# EAGLE design funky_super_usb_r2 (EAGLE 6.1)
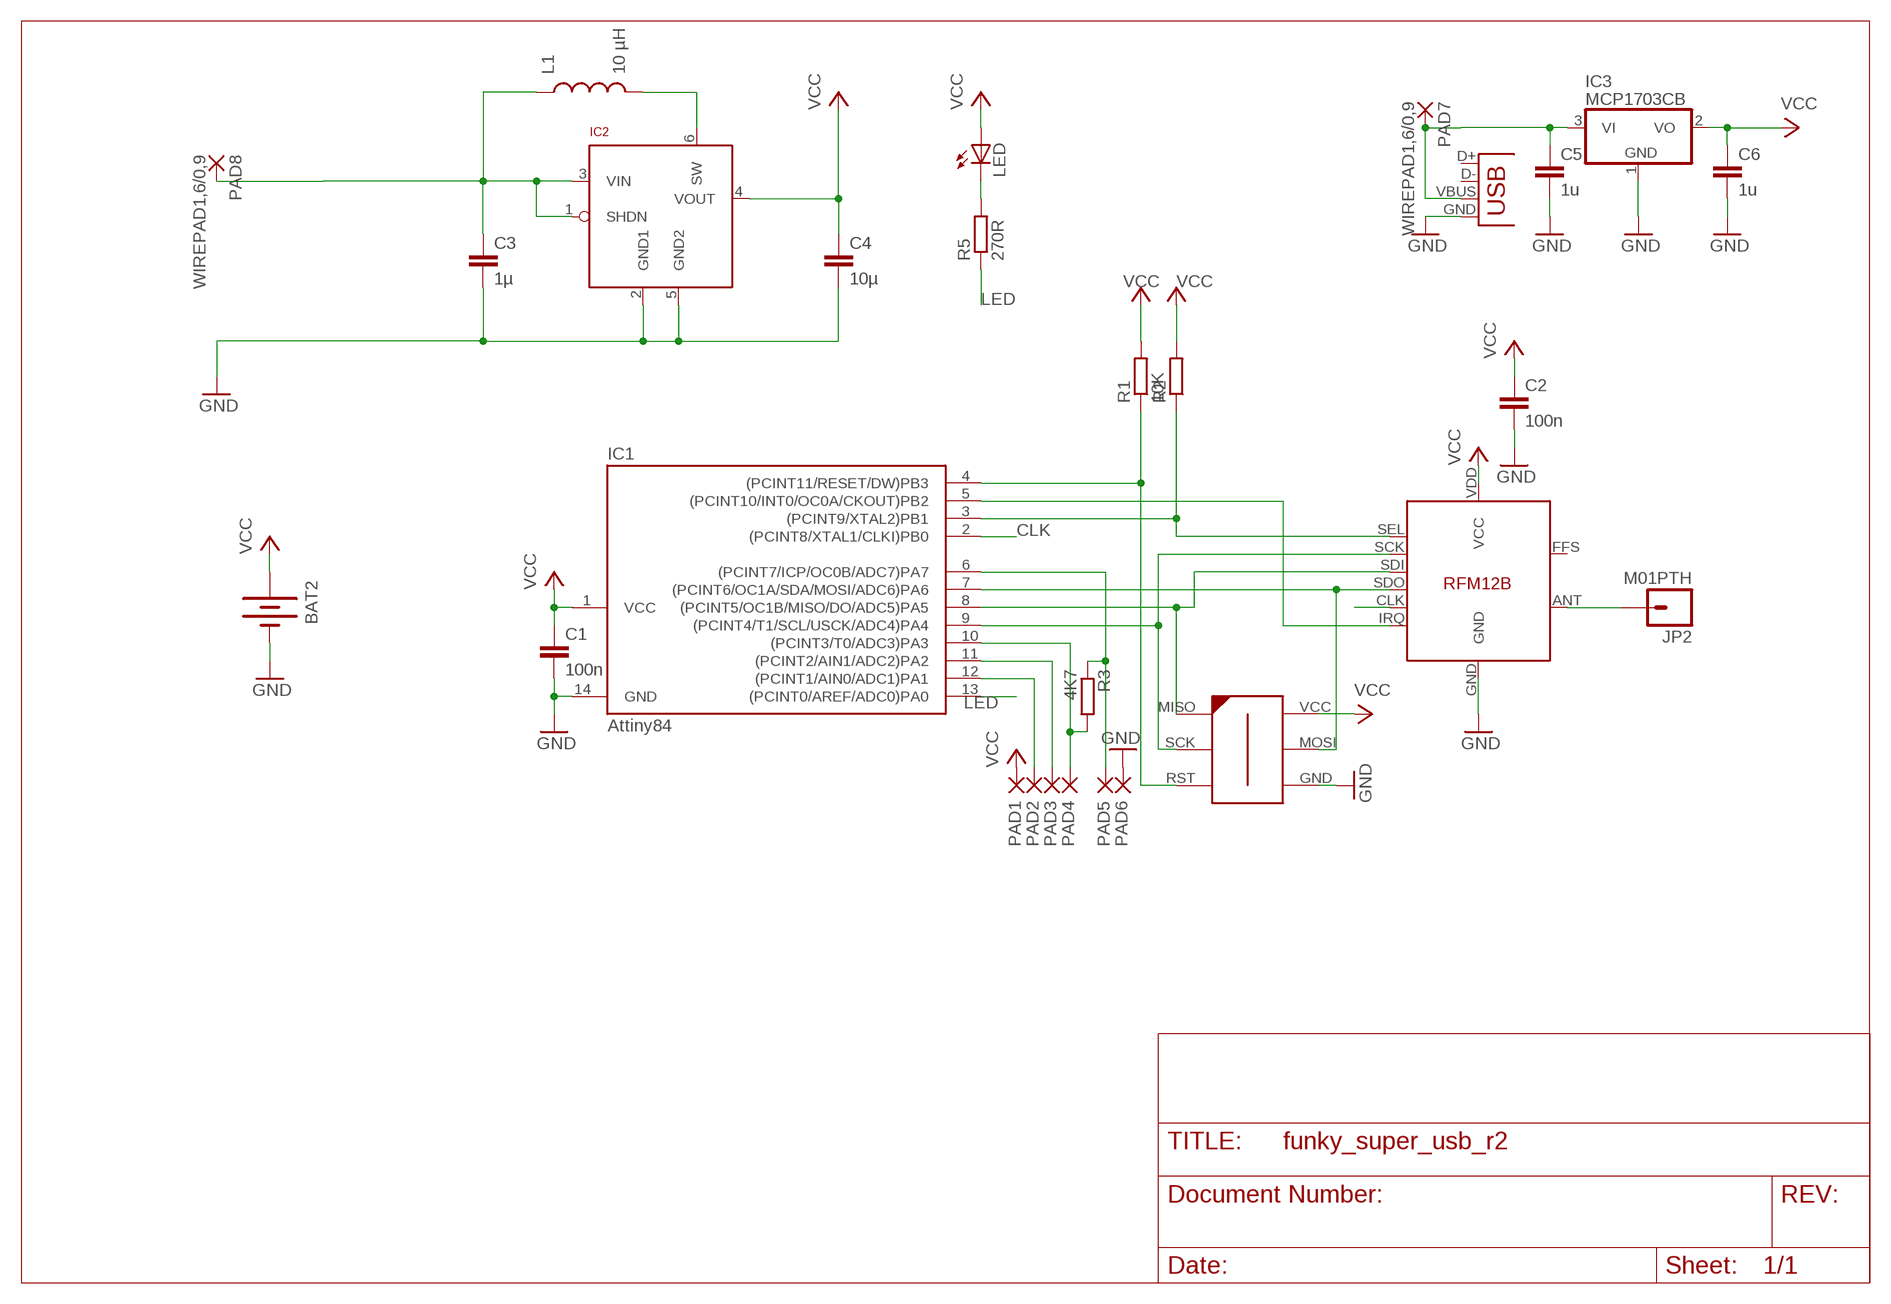
[diagram p0: schematic, sheet 1]

## Parts
BAT2  BATTERY20PTH  [BATTCOM_20MM_PTH]
C1  100n  C-EUC0603K  [C0603K]
C2  100n  C-EUC0603K  [C0603K]
C3  1µ  CAP0603-CAP  [0603-CAP]
C4  10µ  CAP0805  [0805]
C5  1u  C-EUC0603K  [C0603K]
C6  1u  C-EUC0603K  [C0603K]
IC1  Attiny84  TINY24/44/84-SSU  [SOIC14]
IC2  LTC3525  [SC70]
IC3  MCP1703CB  [SOT23]
JP2  M01PTH  [1X01]
L1  10 µH  INDUCTOR1210  [1210]
LED  LED0603  [LED-0603]
PAD1  SMD2  [SMD1,27-2,54]
PAD2  SMD2  [SMD1,27-2,54]
PAD3  SMD2  [SMD1,27-2,54]
PAD4  SMD2  [SMD1,27-2,54]
PAD5  SMD2  [SMD1,27-2,54]
PAD6  SMD2  [SMD1,27-2,54]
PAD7  WIREPAD1,6/0,9  [1,6/0,9]
PAD8  WIREPAD1,6/0,9  [1,6/0,9]
R1  10K  R-EU_R0603  [R0603]
R2  R-EU_R0603  [R0603]
R3  4K7  R-EU_R0603  [R0603]
R5  270R  R-EU_R0603  [R0603]
RFM12B  RFM12B  [RFM12B]
U$2  AVR-ISP-6-EDGE  [6PAD_ISP]
X1  USB-MICROB  [USB-MICROB]

## Nets
CLK: IC1.2((PCINT8/XTAL1/CLKI)PB0) RFM12B.CLK
GND: BAT2.2(-) C1.2 C2.2 C3.2 C4.2 C5.2 C6.2 IC1.14(GND) IC2.2(GND1) IC2.5(GND2) IC3.1(GND) PAD6.1(P) RFM12B.GND U$2.GND X1.GND
LED: IC1.13((PCINT0/AREF/ADC0)PA0) R5.1
N$1: IC1.4((PCINT11/RESET/DW)PB3) R1.1 U$2.RST
N$2: IC1.3((PCINT9/XTAL2)PB1) R2.1 RFM12B.SEL
N$3: JP2.1 RFM12B.ANT
N$4: IC1.9((PCINT4/T1/SCL/USCK/ADC4)PA4) RFM12B.SCK U$2.SCK
N$5: IC1.8((PCINT5/OC1B/MISO/DO/ADC5)PA5) RFM12B.SDI U$2.MISO
N$6: IC1.7((PCINT6/OC1A/SDA/MOSI/ADC6)PA6) RFM12B.SDO U$2.MOSI
N$7: IC1.5((PCINT10/INT0/OC0A/CKOUT)PB2) RFM12B.IRQ
N$8: IC1.6((PCINT7/ICP/OC0B/ADC7)PA7) PAD5.1(P) R3.1
N$9: IC1.10((PCINT3/T0/ADC3)PA3) PAD4.1(P) R3.2
N$10: IC1.11((PCINT2/AIN1/ADC2)PA2) PAD3.1(P)
N$11: IC1.12((PCINT1/AIN0/ADC1)PA1) PAD2.1(P)
N$12: LED.C R5.2
N$13 [power]: IC2.6(SW) L1.2
N$15: C5.1 IC3.3(VI) PAD7.1(P) X1.VBUS
VCC: BAT2.1(+) C1.1 C2.1 C4.1 C6.1 IC1.1(VCC) IC2.4(VOUT) IC3.2(VO) LED.A PAD1.1(P) R1.2 R2.2 RFM12B.VDD(VCC) U$2.VCC
VIN: C3.1 IC2.1(SHDN) IC2.3(VIN) L1.1 PAD8.1(P)
Unconnected: RFM12B.FFS X1.D+ X1.D-

## Library data of the parts
BAT2 = SparkFun:BATTERY: Battery Holders Various common sizes : AA, AAA, 20mm coin cell and 12mm coin cell.
C1 C2 C5 C6 = rcl:C-EU: CAPACITOR, European symbol
C3 C4 = SparkFun:CAP: Capacitor Standard 0603 ceramic capacitor, and 0.1" leaded capacitor.
IC1 = avr-7:TINY24/44/84
IC2 = JeeLabs:LTC3525
IC3 = linear:MCP1703: 250 mA, 16V, Low Quiescent Current LDO Regulator Source: http://ww1.microchip.com/downloads/en/DeviceDoc/22049b.pdf
JP2 = SparkFun:M01: Header 1 Standard 1-pin 0.1" header. Use with straight break away headers (SKU : PRT-00116), right angle break away headers (PRT-00553), swiss pins (PRT-00743), machine pins (PRT-00117), and female headers (PRT-00115).
L1 = SparkFun:INDUCTOR: Inductors Basic Inductor/Choke - 0603 and 1206. Footprints are not proven and vary greatly between part numbers.
LED = SparkFun:LED: LEDs Standard schematic elements and footprints for 5mm, 3mm, 1206, and 0603 sized LEDs. 5mm - Spark Fun Electronics SKU : COM-00529 (and others)
PAD1-PAD6 = wirepad:SMD2: SMD PAD
PAD7 PAD8 = wirepad:WIREPAD: Wire PAD connect wire on PCB
R1-R3 R5 = resistor:R-EU_: RESISTOR, European symbol
RFM12B = JeeParts:RFM12B
U$2 = avr-7:AVR-ISP-6-EDGE: 6 pin edge connector for ISP with ATMEL MCUs. Developed by Craig Moates (craig at moates dot net). Library by David Blundell (blundar at gmail dot com). Often, even a 6 pin header is really inconvenient for board layout and/or production. This SMD-only header is our de-facto standard for using an edge connector for programming with the help of a 6pin/10pin to edge card adapter.
X1 = SparkFun:USB: USB Connectors USB-B-PTH is fully proven SKU : PRT-00139 USB-miniB is fully proven SKU : PRT-00587 USB-A-PCB is untested. USB-A-H is throughly reviewed, but untested. Spark Fun Electronics SKU : PRT-00437 USB-B-SMT is throughly reviewed, but untested. Needs silkscreen touching up. USB-A-S has not been used/tested USB-MB-H has not been used/tested

## Net classes
1 power: width 0.305 mm, clearance 0.203 mm

## Board
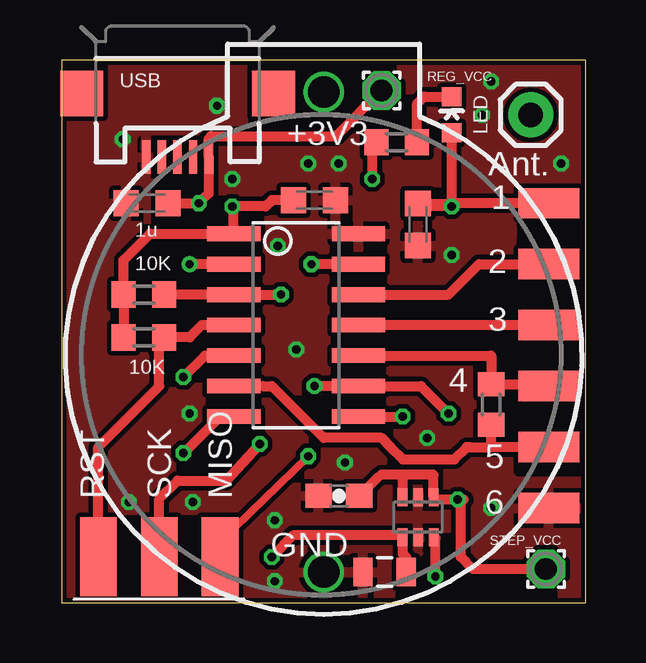
[diagram p1: board, top side]
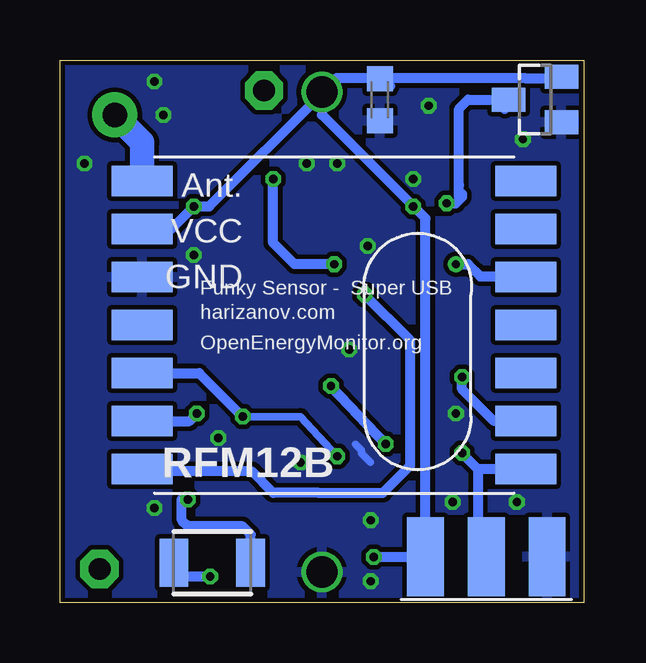
[diagram p2: board, bottom side, seen from below]

Size 21.84 x 22.61 mm. Coordinates in mm from the lower left corner, seen from the top.
Outline: 0,0 21.84,0 21.84,22.61 0,22.61 0,0
Copper layers (1*16): Top 0.035mm / dielectric 1.5mm / Bottom 0.035mm
Design rules: minimum track width 0.2mm, minimum drill 0.3mm, track to track 0.2mm, track to pad 0.2mm, pad to pad 0.2mm, via to via 0.2mm, smd to smd 0.2mm, copper to edge 0.2mm, drill to drill 0.2mm, minimum pad ring 0.2mm, minimum via ring 0.15mm, stop-mask expansion 0.075mm, vias tented up to drill 0.35mm, thermal gap 0.2mm
tRestrict: 5 lines
bRestrict: 2 lines

### Footprints (pad centres in the part's own frame; a part is rotated, then mirrored left to right if it is on the bottom)
BATTCOM_20MM_PTH = drill 1.3: 1 20,0; 2 0,0
C0603K = smd 1.05 x 1.08: 1 -0.875,0; 2 0.875,0
0603-CAP = smd 1.1 x 1: 1 -0.85,0; 2 0.85,0
0805 = smd 0.8 x 1.2: 1 -0.9,0; 2 0.9,0
SOIC14 = smd 0.61 x 2.21: 1 -3.81,-2.603; 2 -2.54,-2.603; 3 -1.27,-2.603; 4 0,-2.603; 5 1.27,-2.603; 6 2.54,-2.603; 7 3.81,-2.603; 8 3.81,2.603; 9 2.54,2.603; 10 1.27,2.603; 11 0,2.603; 12 -1.27,2.603; 13 -2.54,2.603; 14 -3.81,2.603
SC70 = smd 0.4 x 0.75: 1 -0.65,-0.825; 2 0,-0.825; 3 0.65,-0.825; 4 0.65,0.825; 5 0,0.825; 6 -0.65,0.825
SOT23 = smd 1 x 1.4: 1 -0.95,-1.1; 2 0.95,-1.1; 3 0,1.1
1X01 = drill 1.016 pad 1.88: 1 0,0
1210 = smd 1.2 x 2: 1 -1.6,0; 2 1.6,0
LED-0603 = smd 0.8 x 0.8: A 0,-0.75; C 0,0.75
SMD1,27-2,54 = smd 1.27 x 2.54: 1 0,0
1,6/0,9 = drill 0.914 pad 1.6 octagon: 1 0,0
R0603 = smd 1 x 1.1: 1 -0.85,0; 2 0.85,0
RFM12B = smd 2.54 x 1.27: ANT 8,-6; CLK -8,-2; FFS -8,2; GND 8,-2; IRQ -8,4; P$8 -8,0; P$10 -8,-4; P$12 -8,-6; P$16 8,0; SCK 8,4; SDI 8,2; SDO -8,6; SEL 8,6; VDD 8,-4
6PAD_ISP = smd 1.524 x 3.302 bottom: GND 2.54,0; MOSI 0,0; VCC -2.54,0 | smd 1.524 x 3.302: MISO -2.54,0; RST 2.54,0; SCK 0,0
USB-MICROB = smd 0.35 x 1.4: D+ 0,2.65; D- -0.65,2.65; GND 1.3,2.65; ID 0.65,2.65; VBUS -1.3,2.65 | smd 1.8 x 1.9: MT1 -4,0; MT2 4,0

### Placement (x,y rotation side)
BAT2  10.92,1.27 90 top
C1  10.54,16.76 0 top
C2  14.86,15.75 270 top
C3  11.56,4.45 180 top
C4  13.46,1.27 180 top
C5  3.56,16.64 180 top
C6  8.51,20.96 270 bottom
IC1  9.78,11.56 270 top
IC2  14.86,3.56 180 top
IC3  2.03,20.96 90 bottom
JP2  19.56,20.32 0 top
L1  15.49,1.65 180 bottom
LED  16.26,20.32 0 top
PAD1  20.32,16.64 90 top
PAD2  20.32,14.1 90 top
PAD3  20.32,11.56 90 top
PAD4  20.32,9.02 90 top
PAD5  20.32,6.48 90 top
PAD6  20.32,3.94 90 top
PAD7  13.34,21.34 0 top
PAD8  20.19,1.4 0 top
R1  3.43,11.05 180 top
R2  3.43,12.83 180 top
R3  17.91,8.25 90 top
R5  13.97,19.18 0 top
RFM12B  10.41,11.56 180 bottom
U$2  4.06,1.9 180 top
X1  4.83,21.21 180 top

### Tracks (layer width: path | path; a pad name or v marks a point on that pad's centre or on a via)
CLK  (via drill 0.35)
  Top 0.406: IC1.2 v5.33,14.1
  Bottom 0.406: v5.33,14.1 4.83,14.1 4.32,13.59 2.45,13.59 RFM12B.CLK
GND  (via drill 0.35)
  Bottom 0.305: 9.53,6.6 9.27,6.35 9.27,6.22 8.89,5.84
  other vias: 17.91,21.72 2.54,19.3 7.11,17.65 11.56,18.29 9.78,10.54 9.02,14.86 16.26,14.48 15.24,6.86 20.83,18.29 10.29,18.29 6.48,20.7 17.53,20.32 5.46,4.19 2.79,4.19 5.33,7.87 17.91,3.94 8.89,0.89 8.89,3.43 11.81,5.84
  pour Top: 0.25,22.48 21.59,22.48 21.59,0.13 0.25,0.13
  pour Bottom: 0.25,22.48 21.59,22.48 21.59,0.13 0.25,0.13
LED  (via drill 0.35)
  Top 0.406: IC1.13 v10.41,14.1 | v12.95,17.65 12.95,19.39 R5.1
  Bottom 0.406: v10.41,14.1 12.06,14.1 12.95,14.99 v12.95,17.65
N$1
  Top 0.406: U$2.RST 1.52,6.48 4.06,9.02 4.06,11.34 R1.1 5.33,11.05 5.84,11.56 IC1.4
N$2  (via drill 0.35)
  Top 0.406: v9.14,12.83 IC1.3 R2.1
  Bottom 0.2: RFM12B.SEL 18.38,5.49 18.29,5.46
  Bottom 0.406: v9.14,12.83 7.24,10.92 7.24,5.71 8.38,4.57 11.05,4.57 12.95,4.57 13.84,5.46 18.29,5.46
N$3
  Bottom 1.016: RFM12B.ANT 18.41,19.18 JP2.1
N$4  (via drill 0.35)
  Top 0.406: v10.54,9.02 IC1.9 14.99,9.02 v16.13,7.87 | U$2.SCK 4.06,4.32 4.83,5.08 6.86,5.08 v8.26,6.6
  Bottom 0.406: v10.54,9.02 v8.26,6.6 | RFM12B.SCK 16.45,7.56 v16.13,7.87
N$5  (via drill 0.35)
  Top 0.305: U$2.MISO 6.6,2.54 v10.29,6.1
  Top 0.406: IC1.8 v14.22,7.75
  Bottom 0.305: v14.22,7.75 11.81,7.75 v10.29,6.1
  Bottom 0.406: RFM12B.SDI 16.03,9.56 v14.22,7.75
N$6  (via drill 0.35)
  Top 0.406: IC1.7 6.6,7.75 v5.08,6.22
  Bottom 0.406: RFM12B.SDO 4.41,5.56 | 4.41,5.56 v5.08,6.22 | 4.41,5.56 4.41,1.75 U$2.MOSI
N$7  (via drill 0.35)
  Top 0.406: IC1.5 5.97,10.29 v5.08,9.4
  Bottom 0.406: RFM12B.IRQ 3.75,7.56 5.08,8.89 v5.08,9.4
N$8
  Top 0.305: IC1.6 8.38,9.02
  Top 0.406: PAD5.1 17.91,6.48 | 17.91,6.48 R3.1 17.91,6.48 | 16.89,6.48 17.02,6.48 | 17.02,6.48 17.91,6.48 | 8.38,9.02 8.76,9.02 8.89,8.89 10.41,7.37 10.92,6.86 13.34,6.86 13.72,6.48 14.22,5.97 15.37,5.97 16.38,5.97 16.89,6.48 | 16.89,6.48 17.02,6.48 | 16.89,6.48 17.02,6.48
N$9
  Top 0.406: IC1.10 17.91,10.29 R3.2 20.32,9.11 PAD4.1
N$10
  Top 0.406: PAD3.1 IC1.11
N$11
  Top 0.406: IC1.12 16.13,12.83 17.4,14.1 PAD2.1
N$12
  Top 0.406: R5.2 14.82,20.79 15.11,21.08 LED.C
N$13  (via drill 0.35)
  Top 0.305: 15.58,2.69 IC2.6
  Top 0.406: v15.58,1.09 15.58,2.69
  Bottom 0.305: 16.98,1.09 17.18,1.09 L1.2
  Bottom 0.406: 16.98,1.09 v15.58,1.09
N$15  (via drill 0.35)
  Top 0.406: C5.1 v5.71,16.64 6.13,17.05 X1.VBUS 6.13,19.33 6.22,19.43 11.43,19.43 PAD7.1
  Bottom 0.2: IC3.3 3.18,20.69 3.3,20.57 | 5.21,16.89 5.18,16.89 5.13,16.84
  Bottom 0.406: v5.71,16.64 5.33,16.64 5.13,16.84 5.08,16.89 | 3.3,20.57 3.18,20.69 3.17,20.7 | 5.08,17.02 5.21,16.89 5.21,17.4 5.21,20.57 4.83,20.96 IC3.3
VCC  (via drill 0.35)
  Top 0.2: IC2.4 14.18,2.69 14.18,2.79
  Top 0.406: R1.2 R2.2 2.58,14.26 3.68,15.37 IC1.1 7.18,16.57 v7.11,16.51 8.51,16.51 8.76,16.76 C1.1 | v16.26,16.51 14.97,16.51 C2.1 16.14,16.62 v16.26,16.51 | PAD1.1 16.38,16.64 v16.26,16.51 | LED.A v16.26,16.51 | C4.1 14.36,1.89 14.22,2.03 14.22,2.79 14.18,2.79 9.65,2.79 v8.76,1.9
  Bottom 0.2: IC3.2 0.98,21.89 0.98,21.84
  Bottom 0.406: U$2.VCC 6.6,2.41 | 6.6,2.41 6.6,16 v7.11,16.51 10.92,20.32 10.92,21.21 | 10.92,21.21 BAT2.1 10.35,21.84 8.51,21.84 | RFM12B.VDD 17.21,15.56 v16.26,16.51 15.62,16.51 10.92,21.21 | 8.08,21.52 C6.1 | 8.78,21.58 8.51,21.84 | 8.44,21.65 8.51,21.72 8.49,21.73 8.49,21.84 | 8.49,21.84 2.41,21.84 0.98,21.84 0.89,21.84 | 8.49,21.84 C6.1 | C6.1 8.51,21.84 | v8.76,1.9 7.11,1.9 6.6,2.41 | 1.06,21.78 IC3.2
VIN  (via drill 0.35)
  Top 0.254: 15.51,5.32 15.49,5.33 | 14.22,5.33 14.22,4.49 | 14.22,4.49 14.22,4.45 14.22,4.49 | 13.34,5.33 13.21,5.21 13.17,5.21
  Top 0.305: IC2.3 14.18,4.49 14.22,4.49 | 15.58,4.29 IC2.1
  Top 0.406: IC2.1 15.51,5.32 | 15.49,5.33 14.22,5.33 | 14.22,4.49 14.22,5.33 | 14.22,5.33 13.34,5.33 | 13.17,5.21 C3.1 | v16.51,4.29 15.58,4.29 | PAD8.1 17.53,1.4 17.15,1.4 16.64,1.9 16.64,4.19 16.51,4.32 v16.51,4.29 | 16.76,4.29 v16.51,4.29
  Bottom 0.406: L1.1 13.89,2.85 14.22,3.17 16.51,3.17 16.76,3.43 16.76,4.32 16.76,4.29 v16.51,4.29

### Text on the board
tPlace: USB | REG_VCC | +3V3 | Ant. | 1 | 1u | 10K | 2 | 3 | 10K | 4 | 5 | RST | SCK | MISO | 6 | GND | STEP_VCC
bNames: Funky Sensor - Super USB | harizanov.com | OpenEnergyMonitor.org